# Altium schematic sheet controller.SchDoc: Please Work
size A
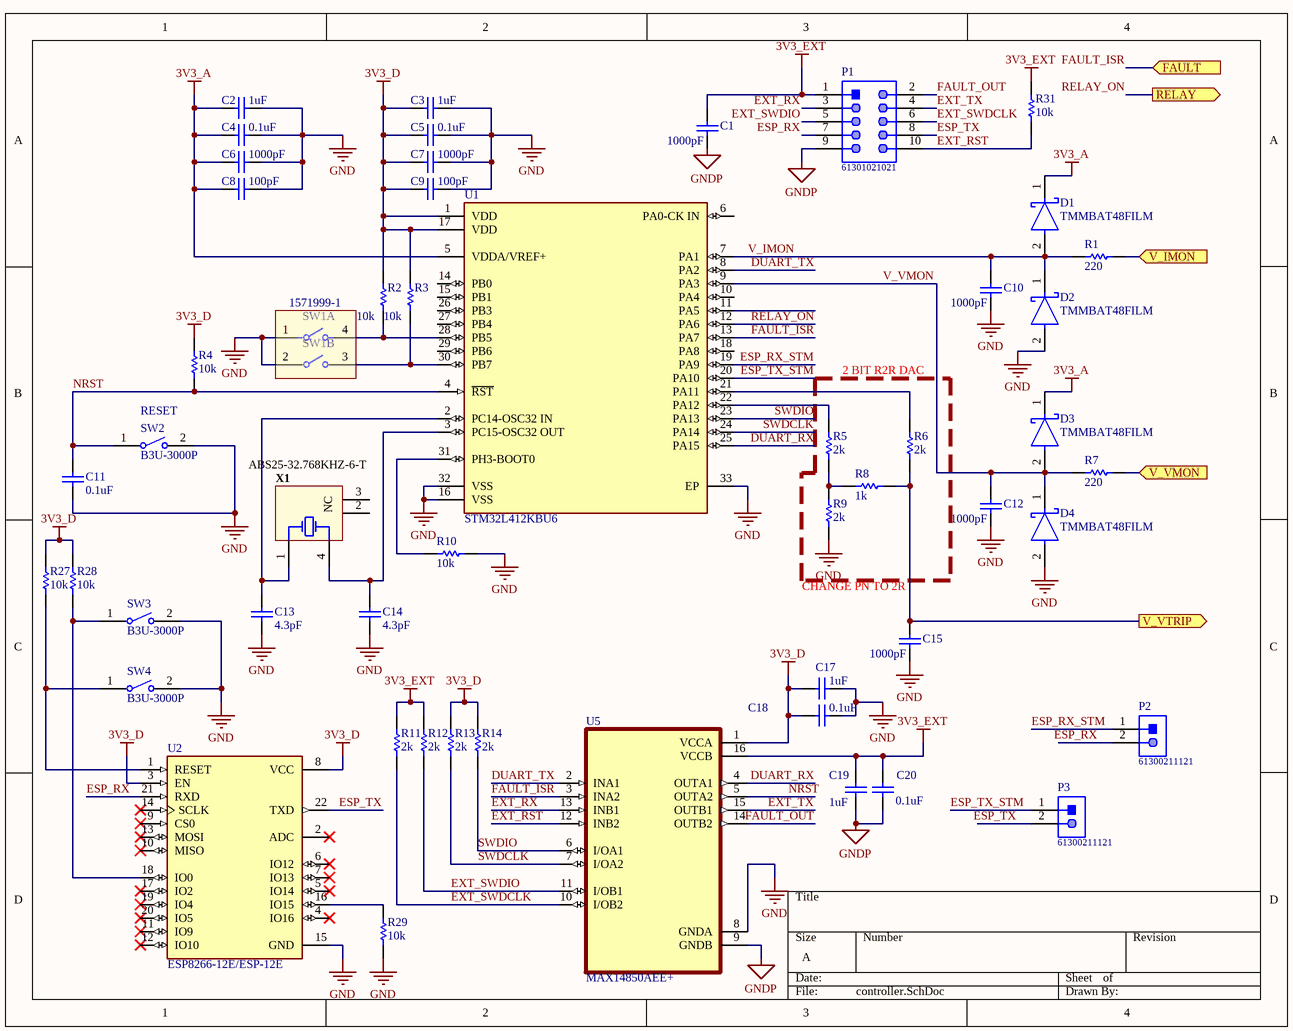
[diagram p0: controller.SchDoc]

## Parts
C1  value 1000pF  [0603C]  (hidden comment: 06033C102JAT2A)
C2  value 1uF  [0603C]  (hidden comment: 0603YD105MAT2A)
C3  value 1uF  [0603C]  (hidden comment: 0603YD105MAT2A)
C4  value 0.1uF  [0603C]  (hidden comment: 06033C104K4T4A)
C5  value 0.1uF  [0603C]  (hidden comment: 06033C104K4T4A)
C6  value 1000pF  [0603C]  (hidden comment: 06033C102JAT2A)
C7  value 1000pF  [0603C]  (hidden comment: 06033C102JAT2A)
C8  value 100pF  [0603C]  (hidden comment: 06033A101FAT2A)
C9  value 100pF  [0603C]  (hidden comment: 06033A101FAT2A)
C10  value 1000pF  [0603C]  (hidden comment: 06033C102JAT2A)
C11  value 0.1uF  [0603C]  (hidden comment: 06033C104K4T4A)
C12  value 1000pF  [0603C]  (hidden comment: 06033C102JAT2A)
C13  value 4.3pF  [0603C]  (hidden comment: 06032U4R3BAT2A)
C14  value 4.3pF  [0603C]  (hidden comment: 06032U4R3BAT2A)
C15  value 1000pF  [0603C]  (hidden comment: 06033C102JAT2A)
C17  value 1uF  [0603C]  (hidden comment: 0603YD105MAT2A)
C18  value 0.1uF  [0603C]  (hidden comment: 06033C104K4T4A)
C19  value 1uF  [0603C]  (hidden comment: 0603YD105MAT2A)
C20  value 0.1uF  [0603C]  (hidden comment: 06033C104K4T4A)
D1  TMMBAT48FILM  [FP-MINIMELF-MFG]
D2  TMMBAT48FILM  [FP-MINIMELF-MFG]
D3  TMMBAT48FILM  [FP-MINIMELF-MFG]
D4  TMMBAT48FILM  [FP-MINIMELF-MFG]
P1  61301021021  [61301021021]
P2  61300211121  [61300211121]
P3  61300211121  [61300211121]
R1  value 220  [0603R]  (hidden comment: ERA-3AEB221V)
R2  value 10k  [0603R]  (hidden comment: ERA-3ARB103V)
R3  value 10k  [0603R]  (hidden comment: ERA-3ARB103V)
R4  value 10k  [0603R]  (hidden comment: ERA-3ARB103V)
R5  value 2k  [0603R]  (hidden comment: ERA-3ARW202V)
R6  value 2k  [0603R]  (hidden comment: ERA-3ARW202V)
R7  value 220  [0603R]  (hidden comment: ERA-3AEB221V)
R8  value 1k  [0603R]  (hidden comment: ERJ-PB3D1001V)
R9  value 2k  [0603R]  (hidden comment: ERA-3ARW202V)
R10  value 10k  [0603R]  (hidden comment: ERA-3ARB103V)
R11  value 2k  [0603R]  (hidden comment: ERA-3ARW202V)
R12  value 2k  [0603R]  (hidden comment: ERA-3ARW202V)
R13  value 2k  [0603R]  (hidden comment: ERA-3ARW202V)
R14  value 2k  [0603R]  (hidden comment: ERA-3ARW202V)
R27  value 10k  [0603R]  (hidden comment: ERA-3ARB103V)
R28  value 10k  [0603R]  (hidden comment: ERA-3ARB103V)
R29  value 10k  [0603R]  (hidden comment: ERA-3ARB103V)
R31  value 10k  [0603R]  (hidden comment: ERA-3ARB103V)
SW1  1571999-1  [FP-1571999-1-MFG]  (parts A,B of 2)
SW2  B3U-3000P  [OMRON-B3U-3000P_V]
SW3  B3U-3000P  [OMRON-B3U-3000P_V]
SW4  B3U-3000P  [OMRON-B3U-3000P_V]
U1  STM32L412KBU6  [FP-UFQFPN32-A0B8-MFG]
U2  ESP8266-12E/ESP-12E  [XCVR_ESP8266-12E/ESP-12E]
U5  MAX14850AEE+  [SOP63P602X175-16N]
X1  ABS25-32.768KHZ-6-T  [ABRA-ABS25-4_V]

## Blocks framed on the sheet
2 BIT R2R DAC: R5 R6 R8 R9

## Ports
FAULT (in), RELAY (out), V_IMON (in), V_VMON (in), V_VTRIP (out)

## Nets
3V3_A: C2.1 C4.1 C6.2 C8.1 D1.1(C) D3.1(C) U1.5(VDDA/VREF+)
3V3_D: C3.1 C5.1 C7.2 C9.1 C17.1 C18.1 R2.2 R3.2 R4.2 R13.2 R14.2 R27.2 R28.2 U1.1(VDD) U1.17(VDD) U2.3(EN) U2.8(VCC) U5.1(VCCA)
3V3_EXT: C1.2 C19.2 C20.2 P1.1 R11.2 R12.2 R31.2 U5.16(VCCB)
GND: C2.2 C3.2 C4.2 C5.2 C6.1 C7.1 C8.2 C9.2 C10.1 C11.1 C12.1 C13.1 C14.1 C15.1 C17.2 C18.2 D2.2(A) D4.2(A) R9.2 R10.1 R29.1 SW1.1 SW1.2 SW2.2 SW3.2 SW4.2 U1.16(VSS) U1.32(VSS) U1.33(EP) U2.15(GND) U5.8(GNDA)
GNDP: C1.1 C19.1 C20.1 P1.9 U5.9(GNDB)
DUART_RX: U1.25(PA15) U5.4(OUTA1)
DUART_TX: U1.8(PA2) U5.2(INA1)
ESP_RX: P1.7 P2.2 U2.21(RXD)
ESP_RX_STM: P2.1 U1.19(PA9)
ESP_TX: P1.8 P3.2 U2.22(TXD)
ESP_TX_STM: P3.1 U1.20(PA10)
EXT_RST: P1.10 R31.1 U5.12(INB2)
EXT_RX: P1.3 U5.13(INB1)
EXT_SWDCLK: P1.6 R11.1 U5.10(I/OB2)
EXT_SWDIO: P1.5 R12.1 U5.11(I/OB1)
EXT_TX: P1.4 U5.15(OUTB1)
FAULT_ISR: U1.13(PA7) U5.3(INA2) ; port FAULT
FAULT_OUT: P1.2 U5.14(OUTB2)
NRST: C11.2 R4.1 SW2.1 U1.4(~{RST}) U5.5(OUTA2)
RELAY_ON: U1.12(PA6) ; port RELAY
SWDCLK: R13.1 U1.24(PA14) U5.7(I/OA2)
SWDIO: R14.1 U1.23(PA13) U5.6(I/OA1)
V_IMON: C10.2 D1.2(A) D2.1(C) R1.1 U1.7(PA1)
V_IMON: R1.2 ; port V_IMON  [a separate net that carries the same name]
V_VMON: C12.2 D3.2(A) D4.1(C) R7.1 U1.9(PA3)
V_VMON: R7.2 ; port V_VMON  [a separate net that carries the same name]
V_VTRIP: C15.2 R6.1 R8.1 ; port V_VTRIP
NetC13_2: C13.2 U1.2(PC14-OSC32_IN) X1.1(X1)
NetC14_2: C14.2 U1.3(PC15-OSC32_OUT) X1.4(X2)
NetR2_1: R2.1 SW1.4 U1.28(PB5)
NetR3_1: R3.1 SW1.3 U1.30(PB7)
NetR5_1: R5.1 R8.2 R9.1
NetR5_2: R5.2 U1.22(PA12)
NetR6_2: R6.2 U1.21(PA11)
NetR10_2: R10.2 U1.31(PH3-BOOT0)
NetR27_1: R27.1 SW4.1 U2.1(RESET)
NetR28_1: R28.1 SW3.1 U2.18(IO0)
NetR29_2: R29.2 U2.16(IO15)

Not connected (* = marked no-connect by the designer): U1 6(PA0-CK_IN) 10(PA4) 11(PA5) 14(PB0) 15(PB1) 18(PA8) 26(PB3) 27(PB4) 29(PB6); U2 2(ADC)* 4(IO16)* 5(IO14)* 6(IO12)* 7(IO13)* 9(CS0)* 10(MISO)* 11(IO9)* 12(IO10)* 13(MOSI)* 14(SCLK)* 17(IO2)* 19(IO4)* 20(IO5)*; X1 2(NC) 3(NC)

## Notes on the sheet
- RESET
- CHANGE PN TO 2R

## Library data of the parts
C1 C6 C7 C10 C12 C15 = 06033C102JAT2A: 0603 1 nF 25 V ±5 % Tolerance X7R Surface Mount Multilayer Ceramic Capacitor; Manufacturer: Kyocera AVX; Capacitance: 1nF; Tolerance: 5%; Voltage Rating (DC): 25V; Supplier Part Number 1: 478-10673-1-ND; Supplier 2: Digi-Key; Manufacturer Part Number: 06033C102JAT2A; RoHS: Yes; Category: Ceramic Capacitors; Stock 2: 72865; Pricing 2: 1=0.27000, 10=0.18600, 50=0.12420, 100=0.10560, 500=0.07452, 1000=0.06520 (USD); Mount: Surface Mount; Case/Package: 0603; Number of Pins: 2; Case Code (Metric): 1608; Case Code (Imperial): 0603; Min Operating Temperature: -55°C; Max Operating Temperature: 125°C; Packaging: Tape and Reel; Dielectric: X7R; Package Quantity: 1; Voltage Rating: 25V; Termination: SMD/SMT; Series: -; Construction: Flat; Length: 1.6mm; Width: 0.032inch; Thickness: 0.035inch; Depth: 0.81mm; Lead Free: Lead Free; RoHS Compliant: Yes; REACH SVHC: Unknown; ComponentLink1URL: https://datasheet.ciiva.com/206/cx7r-206114.pdf?src-supplier=Digi-Key; ComponentLink1Description: https://datasheet.ciiva.com/206/cx7r-206114.pdf?src-supplier=Digi-Key; ComponentLink2URL: https://datasheet.ciiva.com/14886/cx7r-14886873.pdf?src-supplier=Digi-Key; ComponentLink2Description: https://datasheet.ciiva.com/14886/cx7r-14886873.pdf?src-supplier=Digi-Key; ComponentLink3URL: https://datasheet.ciiva.com/14886/cx7r-14886874.pdf?src-supplier=Digi-Key; ComponentLink3Description: https://datasheet.ciiva.com/14886/cx7r-14886874.pdf?src-supplier=Digi-Key; ComponentLink4URL: https://datasheet.ciiva.com/5422/cx7r-218113-5422101.pdf?src-supplier=Mouser; ComponentLink4Description: https://datasheet.ciiva.com/5422/cx7r-218113-5422101.pdf?src-supplier=Mouser; ComponentLink5URL: https://datasheet.ciiva.com/16327/cx7r-16327167.pdf?src-supplier=Future+Electronics; ComponentLink5Description: https://datasheet.ciiva.com/16327/cx7r-16327167.pdf?src-supplier=Future+Electronics; Supplier Part Number 2: 478-7900-1-ND
C2 C3 C17 C19 = 0603YD105MAT2A: AVX - 0603YD105MAT2A - Keramikvielschichtkondensator, SMD, 1 µF, 16 V, 0603 [Metrisch 1608], ± 20%, X5R, AVX 0603 MLCC; Manufacturer: Kyocera AVX; Voltage Rating (DC): 16V; Dissipation Factor: 3.5%; Supplier Part Number 1: 478-10673-1-ND; Supplier 2: Digi-Key; Manufacturer Part Number: 0603YD105MAT2A; RoHS: Yes; Category: Ceramic Capacitors; Stock 2: 32400; Pricing 2: 1=0.17000, 10=0.12100, 50=0.06880, 100=0.05700, 500=0.03998, 1000=0.03310 (USD); Mount: Surface Mount; Case/Package: 0603; Number of Pins: 2; Case Code (Metric): 1608; Case Code (Imperial): 0603; Min Operating Temperature: -55°C; Max Operating Temperature: 85°C; Capacitance: 1uF; Tolerance: 20%; Dielectric: X5R; Packaging: Tape and Reel; Voltage Rating: 16V; Package Quantity: 4000; Termination: SMD/SMT; Series: -; Construction: Flat; Length: 1.6mm; Width: 0.032inch; Height: 0.9mm; Depth: 0.81mm; Thickness: 0.035inch; Radiation Hardening: No; REACH SVHC: No SVHC; Lead Free: Lead Free; RoHS Compliant: Yes; ComponentLink1URL: https://datasheet.ciiva.com/151/cx5r-151029.pdf?src-supplier=Digi-Key; ComponentLink1Description: https://datasheet.ciiva.com/151/cx5r-151029.pdf?src-supplier=Digi-Key; ComponentLink2URL: https://datasheet.ciiva.com/151/cx5r-151030.pdf?src-supplier=Digi-Key; ComponentLink2Description: https://datasheet.ciiva.com/151/cx5r-151030.pdf?src-supplier=Digi-Key; ComponentLink3URL: https://datasheet.ciiva.com/151/cx5r-151031.pdf?src-supplier=Digi-Key; ComponentLink3Description: https://datasheet.ciiva.com/151/cx5r-151031.pdf?src-supplier=Digi-Key; ComponentLink4URL: https://datasheet.ciiva.com/22682/1666675-22682860.pdf?src-supplier=Element14; ComponentLink4Description: https://datasheet.ciiva.com/22682/1666675-22682860.pdf?src-supplier=Element14; ComponentLink5URL: https://datasheet.ciiva.com/28586/1666675-28586031.pdf?src-supplier=Element14; ComponentLink5Description: https://datasheet.ciiva.com/28586/1666675-28586031.pdf?src-supplier=Element14; Supplier Part Number 2: 478-5319-1-ND
C4 C5 C11 C18 C20 = 06033C104K4T4A: Cap Ceramic 0.1uF 25V X7R 10% Pad SMD 0603 125C Automotive T/R; Manufacturer: Kyocera AVX; Capacitance: 100nF; Supplier Part Number 1: 478-10673-1-ND; Supplier 2: Digi-Key; Manufacturer Part Number: 06033C104K4T4A; RoHS: Yes; Category: Ceramic Capacitors; Stock 2: 4996; Pricing 2: 1=0.15000, 10=0.11000, 50=0.06220, 100=0.05150, 500=0.03612, 1000=0.02991, 2500=0.02784, 5000=0.02547 (USD); Mount: Surface Mount; Case/Package: 0603; Min Operating Temperature: -55°C; Max Operating Temperature: 125°C; Tolerance: 10%; Packaging: Tape and Reel; Dielectric: X7R; Voltage Rating (DC): 25V; Construction: Flat; Length: 1.6mm; Depth: 0.81mm; ComponentLink1URL: https://datasheet.ciiva.com/11503/cauto-11503964.pdf?src-supplier=Avnet; ComponentLink1Description: https://datasheet.ciiva.com/11503/cauto-11503964.pdf?src-supplier=Avnet
C8 C9 = 06033A101FAT2A: Multilayer Ceramic Capacitors MLCC - SMD/SMT 25V 100pF C0G 0603 1% Tol; Manufacturer: Kyocera AVX; Supplier Part Number 1: 478-10673-1-ND; Supplier 2: Digi-Key; Manufacturer Part Number: 06033A101FAT2A; RoHS: Yes; Category: Ceramic Capacitors; Stock 2: 17449; Pricing 2: 1=0.50000, 10=0.34500, 50=0.24160, 100=0.20700, 500=0.15524, 1000=0.13110 (USD); Mount: Surface Mount; Case/Package: 0603; Case Code (Imperial): 0603; Case Code (Metric): 1608; Weight: 7.1E-05oz; Min Operating Temperature: -55°C; Max Operating Temperature: 125°C; Capacitance: 100pF; Tolerance: 1%; Dielectric: C0G; Packaging: Tape and Reel; Voltage Rating: 25V; Voltage Rating (DC): 25V; Package Quantity: 4000; Termination: SMD/SMT; Series: 0603; Construction: Flat; Length: 1.6mm; Width: 0.81mm; Height: 0.13mm; Depth: 0.81mm; Thickness: 0.035inch; Radiation Hardening: No; RoHS Compliant: Yes; ComponentLink1URL: https://datasheet.ciiva.com/209/ccog-209628.pdf?src-supplier=Digi-Key; ComponentLink1Description: https://datasheet.ciiva.com/209/ccog-209628.pdf?src-supplier=Digi-Key; Supplier Part Number 2: 478-06033A101FAT2ACT-ND
C13 C14 = 06032U4R3BAT2A: CAP CER 4.3PF 200V NP0 0603; Manufacturer: Kyocera AVX; Dielectric: C0G; Supplier Part Number 1: 478-10673-1-ND; Supplier 2: Digi-Key; Manufacturer Part Number: 06032U4R3BAT2A; RoHS: Yes; Category: Ceramic Capacitors; Stock 2: 15764; Pricing 2: 1=0.35000, 10=0.24200, 50=0.16100, 100=0.13680, 500=0.09660, 1000=0.08452 (USD); Mount: Surface Mount; Case/Package: 0603; Case Code (Imperial): 0603; Case Code (Metric): 1608; Min Operating Temperature: -55°C; Max Operating Temperature: 125°C; Voltage Rating: 200V; Capacitance: 4.3pF; Voltage Rating (DC): 200V; Packaging: Tape and Reel; Package Quantity: 8000; Termination: SMD/SMT; Resistor Type: Ceramic; Series: U; Construction: Flat; Length: 0.06inch; Width: 0.81mm; Thickness: 0.036inch; Depth: 0.76mm; Radiation Hardening: No; RoHS Compliant: Yes; ComponentLink1URL: https://datasheet.ciiva.com/207/useries-207438.pdf?src-supplier=Digi-Key; ComponentLink1Description: https://datasheet.ciiva.com/207/useries-207438.pdf?src-supplier=Digi-Key; ComponentLink2URL: https://datasheet.ciiva.com/11570/useries-11570909.pdf?src-supplier=Avnet; ComponentLink2Description: https://datasheet.ciiva.com/11570/useries-11570909.pdf?src-supplier=Avnet; Supplier Part Number 2: 478-10269-1-ND
D1-D4 = CMP-12187-000003-1: DIODE SCHOTTKY 40V 350MA MINMELF; Manufacturer: STMicroelectronics; Max Surge Forward Current: 1.5A; Value: 20pF; Max Junction Temp: +125°C; Peak Reverse Current: 25uA; ComponentLink2Description: Datasheet; Manufacturer Part Number: TMMBAT48FILM; Height: 1.62mm; Forward Current: 350mA; Temperature: -65°C to +125°C; Max Repetitive Reverse Voltage: 40V; Category: Diode; Temperature Range Low: -65°C; Reverse Voltage: 40V; Device Class L3: Schottky Diodes; RoHS: TRUE; Digikey Description: DIODE SCHOTTKY 40V 350MA MINMELF; ComponentLink2URL: https://www.st.com/resource/en/datasheet/tmmbat48.pdf; Temperature Range High: +125°C; Octopart: https://octopart.com/tmmbat48film-stmicroelectronics-324396; Lead Free: Yes; Capacitance: 20pF; Device Class L1: Discrete Semiconductors; Device Class L2: Diodes; Automotive: No; Package: MINIMELF; Mouser Description: Schottky Diodes & Rectifiers 350mA 40 Volt
P1 = CMP-1502-01083-1: THT Angled Pin Header WR-PHD, Pitch 2.54 mm, Dual Row, 10 pins; Manufacturer: Wurth Elektronik; Pin Number: 10; Working Voltage: 250VAC; Contact Resistance: 20mOhm; Rated Current: 3A; Withstanding Voltage: 500VAC; Gender: Male; Pitch: 2.54mm; Orientation: Angled; Part Number: 61301021021; Publisher: WurthElektronik; Manufacturer URL: http://www.we-online.de; Packaging: Bag; Row Number: Dual; Package Reference: 61301021021; Operating Temperature: -40to105degC; Mounting Technology: THT; Datasheet URL: https://katalog.we-online.de/em/datasheet/6130xx21021.pdf
P2 P3 = CMP-1712-00002-4: THT Vertical Pin Header WR-PHD, Pitch 2.54 mm, Single Row, 2 pins; Manufacturer: Wurth Elektronik; Rated Current: 3A; Gender: Male; Withstanding Voltage: 500VAC; Working Voltage: 250VAC; Pitch: 2.54mm; Contact Resistance: 20mOhm; Pin Number: 2; Mounting Technology: THT; Orientation: Vertical; Operating Temperature: -40to105degC; Packaging: Bag; Publisher: WurthElektronik; Datasheet URL: https://katalog.we-online.de/em/datasheet/6130xx11121.pdf; Manufacturer URL: http://www.we-online.de; Row Number: Single; Package Reference: 61300211121; Part Number: 61300211121
R1 R7 = ERA-3AEB221V: Resistor, SMD 220 Ohm 0603  ±  0.1 %, ERA3AEB221V, Panasonic Automotive & Industrial Systems; Resistance: 220R; Tolerance: 0.1%; Temperature Coefficient: 25ppm/°C; Power Rating: 100mW; Voltage Rating: 75V; Supplier 1: Digi-Key; Manufacturer: Panasonic; Manufacturer Part Number: ERA3AEB221V; RoHS: Yes; Category: Chip SMD Resistors; Stock 1: 28927; Pricing 1: 1=0.31000, 10=0.26000, 100=0.10150, 1000=0.04248, 2500=0.03894 (USD); Mount: Surface Mount; Case/Package: 0603; Number of Pins: 2; Contact Plating: Tin; Case Code (Metric): 1608; Case Code (Imperial): 0603; Min Operating Temperature: -55°C; Max Operating Temperature: 155°C; Resistor Type: Thin Film; Packaging: Tape and Reel; Package Quantity: 1; Number of Terminations: 2; Termination: SMD/SMT; Max Power Dissipation: 100mW; Voltage Rating (DC): 75V; Features: Automotive AEC-Q200; Series: ERA-3A; Construction: Rectangular; Resistance Tolerance: 0.1%; Technology: METAL FILM; Length: 1.6mm; Width: 0.8mm; Height: 0.45mm; Depth: 0.8mm; Radiation Hardening: No; REACH SVHC: No SVHC; Military Standard: Not; Lead Free: Lead Free; RoHS Compliant: Yes; ComponentLink1URL: https://datasheet.ciiva.com/11808/0900766b80fe20f7-11808055.pdf?src-supplier=RSComponents; ComponentLink1Description: https://datasheet.ciiva.com/11808/0900766b80fe20f7-11808055.pdf?src-supplier=RSComponents; ComponentLink2URL: https://datasheet.ciiva.com/29183/450451-da-01-en-widerstand-0603-era-29183676.pdf?src-supplier=Conrad; ComponentLink2Description: https://datasheet.ciiva.com/29183/450451-da-01-en-widerstand-0603-era-29183676.pdf?src-supplier=Conrad; ComponentLink3URL: https://datasheet.ciiva.com/43455/485442-43455212.pdf?src-supplier=Farnell; ComponentLink3Description: https://datasheet.ciiva.com/43455/485442-43455212.pdf?src-supplier=Farnell; ComponentLink4URL: https://datasheet.ciiva.com/6000/485442-6000910.pdf?src-supplier=Farnell; ComponentLink4Description: https://datasheet.ciiva.com/6000/485442-6000910.pdf?src-supplier=Farnell; ComponentLink5URL: https://datasheet.ciiva.com/9184/aoa0000ce26-9184316.pdf?src-supplier=Avnet; ComponentLink5Description: https://datasheet.ciiva.com/9184/aoa0000ce26-9184316.pdf?src-supplier=Avnet; ComponentLink6URL: https://datasheet.ciiva.com/9117/aoa0000ce26-9117624.pdf?src-supplier=Avnet; ComponentLink6Description: https://datasheet.ciiva.com/9117/aoa0000ce26-9117624.pdf?src-supplier=Avnet; ComponentLink7URL: https://datasheet.ciiva.com/30089/54aoa0000ce26-30089206.pdf?src-supplier=Onlinecomponents.com; ComponentLink7Description: https://datasheet.ciiva.com/30089/54aoa0000ce26-30089206.pdf?src-supplier=Onlinecomponents.com; ComponentLink8URL: https://datasheet.ciiva.com/17206/aoa0000ce26-17206814.pdf?src-supplier=Avnet+Europe; ComponentLink8Description: https://datasheet.ciiva.com/17206/aoa0000ce26-17206814.pdf?src-supplier=Avnet+Europe; ComponentLink9URL: https://datasheet.ciiva.com/48530/era-eng-tds-48530567.pdf?src-supplier=Distrelec; ComponentLink9Description: https://datasheet.ciiva.com/48530/era-eng-tds-48530567.pdf?src-supplier=Distrelec; ComponentLink10URL: https://datasheet.ciiva.com/7886/485442-7886586.pdf?src-supplier=Element14; ComponentLink10Description: https://datasheet.ciiva.com/7886/485442-7886586.pdf?src-supplier=Element14; ComponentLink11URL: https://datasheet.ciiva.com/22739/485442-22739289.pdf?src-supplier=Element14; ComponentLink11Description: https://datasheet.ciiva.com/22739/485442-22739289.pdf?src-supplier=Element14; ComponentLink12URL: https://datasheet.ciiva.com/48425/era-eng-tds-48425439.pdf?src-supplier=Distrelec; ComponentLink12Description: https://datasheet.ciiva.com/48425/era-eng-tds-48425439.pdf?src-supplier=Distrelec; Supplier Part Number 1: P220DBCT-ND
R2-R4 R10 R27-R29 R31 = ERA-3ARB103V: Resistor, SMD 10 kOhm 0603  ±  0.1 %, ERA3ARB103V, Panasonic Automotive & Industrial Systems; Resistance: 10kR; Tolerance: 0.1%; Temperature Coefficient: 10ppm/°C; Power Rating: 100mW; Voltage Rating: 75V; Voltage Rating (DC): 150V; Published: 8-Jun-2000; LatestRevisionDate: 17-Jul-2002; LatestRevisionNote: Re-released for DXP Platform.; PackageReference: 0603 MET; Publisher: Altium Limited; PackageDescription: Axial Device, Thru-Hole; 2 Leads; 0.3 in Pin Spacing; Supplier 1: Digi-Key; Manufacturer: Panasonic; Manufacturer Part Number: ERA-3ARB103V; RoHS: Yes; Category: Chip SMD Resistors; Stock 1: 16117; Pricing 1: 1=0.72000, 10=0.53000, 100=0.30890, 1000=0.17322, 2500=0.16973 (USD); Mount: Surface Mount; Case/Package: 0603; Number of Pins: 2; Contact Plating: Tin; Case Code (Metric): 1608; Case Code (Imperial): 0603; Min Operating Temperature: -55°C; Max Operating Temperature: 155°C; Resistor Type: Metal Film,Thin Film; Packaging: Tape and Reel; Package Quantity: 5000; Number of Terminations: 2; Termination: SMD/SMT; Max Power Dissipation: 100mW; Series: ERA-3A; Construction: Rectangular; Resistance Tolerance: 0.1%; Length: 1.6mm; Width: 0.031inch; Height: 0.022inch; Depth: 0.8mm; Radiation Hardening: No; REACH SVHC: No SVHC; Military Standard: Not; Lead Free: Lead Free; RoHS Compliant: Yes; ComponentLink1URL: https://datasheet.ciiva.com/48425/era-eng-tds-48425501.pdf?src-supplier=Distrelec; ComponentLink1Description: https://datasheet.ciiva.com/48425/era-eng-tds-48425501.pdf?src-supplier=Distrelec; ComponentLink2URL: https://datasheet.ciiva.com/17212/aoa0000ce26-17212075.pdf?src-supplier=Avnet+Europe; ComponentLink2Description: https://datasheet.ciiva.com/17212/aoa0000ce26-17212075.pdf?src-supplier=Avnet+Europe; Supplier Part Number 1: P10KBDCT-ND
R5 R6 R9 R11-R14 = ERA-3ARW202V: 2k Panasonic Resistor; Supplier 1: Digi-Key; Supplier Part Number 1: P2.0KBECT-ND
R8 = ERJ-PB3D1001V: PANASONIC - ERJ-PB3D1001V - CHIP RES, THICK FILM, 1K, 0.2W, 0603; Resistance: 1kR; Tolerance: 0.5%; Max Power Dissipation: 200mW; Temperature Coefficient: 50ppm/°C; Supplier 1: Digi-Key; Manufacturer: Panasonic; Manufacturer Part Number: ERJ-PB3D1001V; RoHS: Yes; Category: Chip SMD Resistors; Stock 1: 4491; Pricing 1: 1=0.16000, 10=0.13500, 25=0.09840, 50=0.07140, 100=0.05290, 250=0.04060, 500=0.03198, 1000=0.02214 (USD); Case/Package: 0603; Case Code (Metric): 1608; Case Code (Imperial): 0603; Min Operating Temperature: -55°C; Max Operating Temperature: 155°C; Packaging: Tape and Reel; Resistor Type: Thick Film; Number of Terminations: 2; Features: Automotive AEC-Q200; Length: 0.063inch; Width: 0.032inch; Height - Seated (Max): 0.022inch; ComponentLink1URL: https://industrial.panasonic.com/cdbs/www-data/pdf/RDM0000/DMM0000COL5.pdf?src-supplier=Digi-Key; ComponentLink1Description: https://industrial.panasonic.com/cdbs/www-data/pdf/RDM0000/DMM0000COL5.pdf?src-supplier=Digi-Key; ComponentLink2URL: https://industrial.panasonic.com/sa/system/files/data/download/catalog/id_fixed-resistors_e_2.pdf?src-supplier=Digi-Key; ComponentLink2Description: https://industrial.panasonic.com/sa/system/files/data/download/catalog/id_fixed-resistors_e_2.pdf?src-supplier=Digi-Key; ComponentLink3URL: http://www.farnell.com/datasheets/2286937.pdf?src-supplier=Newark; ComponentLink3Description: http://www.farnell.com/datasheets/2286937.pdf?src-supplier=Newark; Supplier Part Number 1: P20283CT-ND
SW1 = CMP-03400-000051-1: SWITCH PIANO DIP SPST 100MA 24V; Sealable: No (Without); Washable: Yes; Pitch: 0.1inch; Switching Capacity: 400mW; Number of Positions: 2; Voltage Rating (DC): 5V; Contact Resistance: 50mR; Actuator Material: Nylon; Contact Post Length: 4mm; Electrical Life: 1000Cycles; Actuator Length: 2.1mm; Contact Current Rating: 1A; Type: Switch; Max Voltage Rating (DC): 24V; Flammability Rating: UL94 V-0; Package Quantity: 60; Contact Plating: Gold; Max Current Rating: 100mA; RoHS Compliant: Yes; Terminal Pitch: 2.54mm; Orientation: Straight; Lead Free: Lead Free; Housing Material: Polyphenylene; ELV: Compliant; Contact Material: Copper Alloy; Packaging: Rail/Tube; Termination: PC Pins; Max Operating Temperature: 85°C; Radiation Hardening: No; REACH SVHC: No SVHC; Housing Color: Black; Height: 0.236inch; Actuator Type: PIANO; Width: 8.62mm; Min Operating Temperature: -30°C; Number of Circuits: 2; Mount: Through Hole; Series: ADP, Alcoswitch; Throw Configuration: SPST; Number of Pins: 2; Length: 7.06mm
SW2-SW4 = CMP-1677-00003-1: Ultra-Small Tactile Switch, 1 to 50 mA, 3 to 12 V, -25 to 70 degC, 2-Pin SMD, RoHS, Tape and Reel; Tolerance: 20%; Voltage Rating (DC): 50 V; Capacitance: 470 uF; Case\Package: Radial; PackageReference: B3U-3000P; Min Operating Temperature: -40 degC; Length: 20 mm; Mount: Through Hole; ComponentLink2Description: Datasheet; RoHSCompliant: true; ComponentLink1URL: http://www.omron.com/; Package Quantity: 200; Radiation Hardening: No; Height: 20 mm; ComponentLink2URL: https://www.omron.com/ecb/products/pdf/en-b3u.pdf; Diameter: 10 mm; Max Operating Temperature: 85 degC; Lead Pitch: 5 mm; DatasheetVersion: Jan-15; Packaging: Bulk; PackageDescription: 2-Pin Surface Mount Device, Body 4 x 3.2 mm; Voltage Rating: 50 V; Pins: 2; ComponentLink1Description: Manufacturer URL; REACH SVHC: No SVHC
U1 = CMP-12105-000015-1: IC MCU 32BIT 128KB FLASH 32QFPN; Manufacturer: STMicroelectronics; Frequency: 80MHz; Number Of Uart Channels: 3; Number Of I2C Channels: 2; Core Architecture: ARM Cortex-M4; Min Supply Voltage: 1.71V; Interface: I2C,SPI,UART,USART,USB,LIN,IrDA,SMBus,Other; Number Of Adc Channels: 10; Memory Size: 128KBytes; Number Of Timers/Counters: 7; Number Of I/Os: 26; Max Supply Voltage: 3.6V; Max Junction Temp: +105°C; Number Of Pwm Channels: 11; Ram Size: 40KBytes; Number Of Spi Channels: 1; Data Bus Width: 32bits; Manufacturer Part Number: STM32L412KBU6; ComponentLink2Description: Datasheet; Device Class L1: Integrated Circuits (ICs); Package: UFQFPN32-A0B8; Device Class L3: Microcontrollers; ComponentLink2URL: https://www.st.com/resource/en/datasheet/stm32l412kb.pdf; Number Of A/D Converters: 2; Memory Type: FLASH; Temperature: -40°C to +105°C; Lead Free: Yes; Temperature Range High: +105°C; Temperature Range Low: -40°C; Automotive: No; Number Of Usb Channels: 1; Ambient Temperature Range High: +85°C; RoHS: TRUE; Number Of Cores: 1; Height: 0.6mm; Category: IC; Digikey Description: IC MCU 32BIT 128KB FLASH 32QFPN; Device Class L2: Embedded Processors and Controllers; Octopart: https://octopart.com/stm32l412kbu6-stmicroelectronics-94438340; Ambient Temperature Range Low: -40°C
U2 = ESP8266-12E/ESP-12E: ESP-12E WiFi Module; MF: {'manufacturer': u'AI-Thinker'}; Package: None; Value: *; Availability: Unavailable; MP: ESP8266-12E/ESP-12E; Price: None
U5 = MAX14850AEE+: General Purpose Digital Isolator 600Vrms 6 Channel 2Mbps, 50Mbps 1.5kV/Âµs CMTI 16-SSOP (0.154, 3.90mm Width); MF: Maxim Integrated; Price: None; Package: QSOP-16 Maxim; Availability: Unavailable; MP: MAX14850AEE+; Value: *; SnapEDA_Link: https://www.snapeda.com/parts/MAX14850AEE+/Maxim%20Integrated/view-part/1150679/?ref=snap
X1 = CMP-2000-05036-1: Low Frequency Crystal, 32.768 KHz, 6 pF, +/- 20 ppm, -40 to 85 degC, 4-Pin SMD, RoHS, Tape and Reel; Manufacturer: Abracon; Tolerance: 20PPM; ESR: 50kOhms; Case Width: 3.8mm; Case Height: 2.5mm; Case Length: 8mm; Load Capacitance: 6pF; Operating Temperature Range: -40Cto+85C; Package Reference: ABS25; Factory Pack Quantity: 3000; Package Description: 4-Pin Surface Mount Device, Body 8 x 3.8 mm, Pitch 5.5 mm; Frequency: 32.768kHz; Termination Style: SMD/SMT; Manufacturer URL: http://www.abracon.com/; Type: LowFrequencyCrystal; Dimensions: 3.8mmWx8mmLx2.5mmH; Product Category: Crystals; Series: ABS25; RoHS: Details; Package / Case: 8mmx3.8mm; Datasheet Version: Jun-17; Brand: ABRACON; Datasheet URL: https://datasheet.ciiva.com/854/abs25-854528.pdf; Packaging: Reel; Mounting Style: SMD/SMT